# EAGLE design 526_outin_picoRev101 (EAGLE 9.6.0)
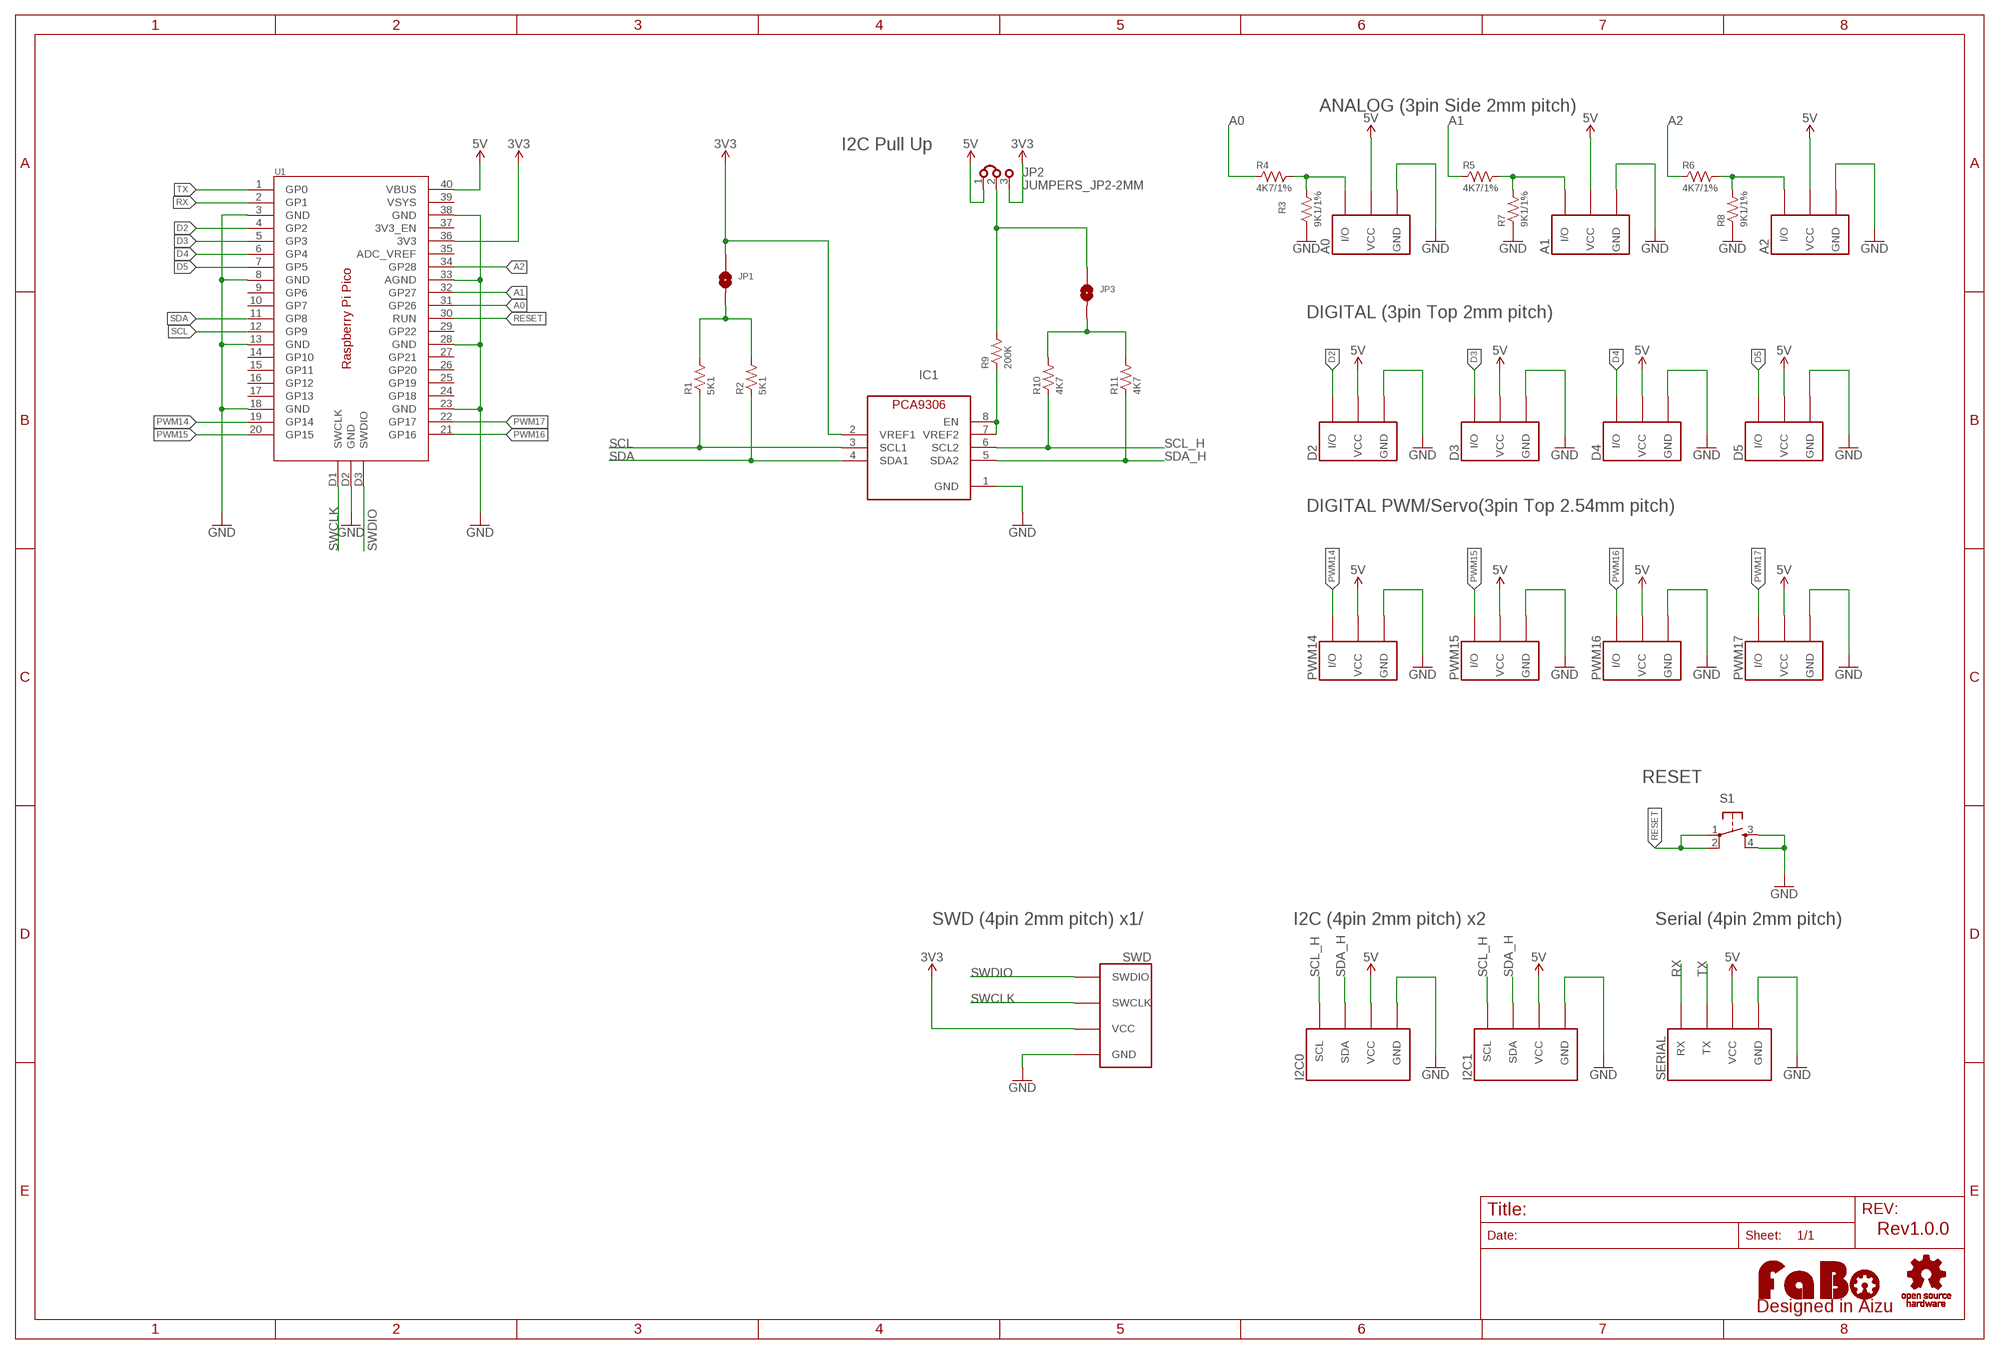
[diagram p0: schematic, sheet 1]

## Parts
A0  FABO_BRICK_3PIN-S03B-PASK-2_LONG  [FABO_BRICK_3PIN_S03B-PASK-2_LONG]
A1  FABO_BRICK_3PIN-S03B-PASK-2_LONG  [FABO_BRICK_3PIN_S03B-PASK-2_LONG]
A2  FABO_BRICK_3PIN-S03B-PASK-2_LONG  [FABO_BRICK_3PIN_S03B-PASK-2_LONG]
D2  FABO_BRICK_3PIN-B03B-PASK-1  [FABO_BRICK_3PIN_B03B-PASK-1]
D3  FABO_BRICK_3PIN-B03B-PASK-1  [FABO_BRICK_3PIN_B03B-PASK-1]
D4  FABO_BRICK_3PIN-B03B-PASK-1  [FABO_BRICK_3PIN_B03B-PASK-1]
D5  FABO_BRICK_3PIN-B03B-PASK-1  [FABO_BRICK_3PIN_B03B-PASK-1]
I2C0  FABO_BRICK_I2C-B04B-PASK-1  [FABO_BRICK_I2C_B04B-PASK-1]
I2C1  FABO_BRICK_I2C-B04B-PASK-1  [FABO_BRICK_I2C_B04B-PASK-1]
IC1  PCA9306_SSOP  [8PIN-SSOP]
JP1  SMD-JUMPER-2_SHORT  [SMD-JUMPER-2-SHORT]
JP2  JUMPERS_JP2-2MM  [JUMPERS_JP2-2MM]
JP3  SMD-JUMPER-2_SHORT  [SMD-JUMPER-2-SHORT]
LOGO1  LOGO_OSHW-M_BOTTOM  [LOGO_OSHW_M_BOTTOM]
LOGO2  LOGO_FABO-M  [LOGO_FABO_M]
PWM14  FABO_BRICK_3PIN-HEADER  [FABO_BRICK_3PIN_HEADER]
PWM15  FABO_BRICK_3PIN-HEADER  [FABO_BRICK_3PIN_HEADER]
PWM16  FABO_BRICK_3PIN-HEADER  [FABO_BRICK_3PIN_HEADER]
PWM17  FABO_BRICK_3PIN-HEADER  [FABO_BRICK_3PIN_HEADER]
R1  5K1  RESISTOR-0603  [0603]
R2  5K1  RESISTOR-0603  [0603]
R3  9K1/1%  RESISTOR-0603  [0603]
R4  4K7/1%  RESISTOR-0603  [0603]
R5  4K7/1%  RESISTOR-0603  [0603]
R6  4K7/1%  RESISTOR-0603  [0603]
R7  9K1/1%  RESISTOR-0603  [0603]
R8  9K1/1%  RESISTOR-0603  [0603]
R9  200K  RESISTOR-0603  [0603]
R10  4K7  RESISTOR-0603  [0603]
R11  4K7  RESISTOR-0603  [0603]
S1  TACT-SWITCH-6MM  [DTS_6_V]
SERIAL  FABO_BRICK_SERIAL-B04B-PASK-1  [FABO_BRICK_SERIAL_B04B-PASK-1]
SWD  FABO-SWD-4PIN  [FABO_BRICK_SWD_B04B-PASK-1_SILK]
U1  RASPBERRY_PI_PICO  [RASPBERRY_PI_PICO_SMD]

## Nets
3V3: IC1.2(VREF1) JP1.1 JP2.3 SWD.VCC U1.36(3V3)
5V: A0.VCC A1.VCC A2.VCC D2.VCC D3.VCC D4.VCC D5.VCC I2C0.VCC I2C1.VCC JP2.1 PWM14.VCC PWM15.VCC PWM16.VCC PWM17.VCC SERIAL.VCC U1.40(VBUS)
A0: R4.1 U1.31(GP26)
A1: R5.1 U1.32(GP27)
A2: R6.1 U1.34(GP28)
D2: D2.I/O U1.4(GP2)
D3: D3.I/O U1.5(GP3)
D4: D4.I/O U1.6(GP4)
D5: D5.I/O U1.7(GP5)
GND: A0.GND A1.GND A2.GND D2.GND D3.GND D4.GND D5.GND I2C0.GND I2C1.GND IC1.1(GND) PWM14.GND PWM15.GND PWM16.GND PWM17.GND R3.1 R7.1 R8.1 S1.3 S1.4 SERIAL.GND SWD.GND U1.3(GND) U1.8(GND) U1.13(GND) U1.18(GND) U1.23(GND) U1.28(GND) U1.33(AGND) U1.38(GND) U1.D2(GND)
N$1: A0.I/O R3.2 R4.2
N$2: A1.I/O R5.2 R7.2
N$3: JP1.2 R1.2 R2.2
N$4: A2.I/O R6.2 R8.2
N$10: JP2.2 JP3.1 R9.2
N$11: JP3.2 R10.2 R11.2
N$12: IC1.7(VREF2) IC1.8(EN) R9.1
PWM14: PWM14.I/O U1.19(GP14)
PWM15: PWM15.I/O U1.20(GP15)
PWM16: PWM16.I/O U1.21(GP16)
PWM17: PWM17.I/O U1.22(GP17)
RESET: S1.1 S1.2 U1.30(RUN)
RX: SERIAL.RX U1.2(GP1)
SCL: IC1.3(SCL1) R1.1 U1.12(GP9)
SCL_H: I2C0.SCL I2C1.SCL IC1.6(SCL2) R10.1
SDA: IC1.4(SDA1) R2.1 U1.11(GP8)
SDA_H: I2C0.SDA I2C1.SDA IC1.5(SDA2) R11.1
SWCLK: SWD.SWCLK U1.D1(SWCLK)
SWDIO: SWD.SWDIO U1.D3(SWDIO)
TX: SERIAL.TX U1.1(GP0)
Unconnected: U1.9(GP6) U1.10(GP7) U1.14(GP10) U1.15(GP11) U1.16(GP12) U1.17(GP13) U1.24(GP18) U1.25(GP19) U1.26(GP20) U1.27(GP21) U1.29(GP22) U1.35(ADC_VREF) U1.37(3V3_EN) U1.39(VSYS)

## Notes on the sheet
- ANALOG (3pin Side 2mm pitch)
- I2C Pull Up
- DIGITAL (3pin Top 2mm pitch)
- DIGITAL PWM/Servo(3pin Top 2.54mm pitch)
- RESET
- SWD (4pin 2mm pitch) x1/ | I2C (4pin 2mm pitch) x2 | Serial (4pin 2mm pitch)
- Rev1.0.0

## Library data of the parts
A0 A1 A2 D2-D5 PWM14-PWM17 = FaBo-Template:FABO_BRICK_3PIN: FaBo Brick 3pin
I2C0 I2C1 = FaBo-Template:FABO_BRICK_I2C: FaBo Brick I2C
IC1 = FaBo-LevelTranslator:PCA9306
JP1 JP3 = FaBo-PIN:SMD-JUMPER-2
JP2 = 52101-101-REV-A_v16:JUMPERS_JP2-: Jumper/Bridge
LOGO1 = FaBo-Logo:LOGO_OSHW
LOGO2 = FaBo-Logo:LOGO_FABO
R1-R11 = FaBo-Resistors:RESISTOR: RESISTOR
S1 = FaBo-Switch:TACT-SWITCH
SERIAL = FaBo-Template:FABO_BRICK_SERIAL: FaBo Brick Serial
SWD = FaBo-Connetor:FABO-SWD-4PIN
U1 = FaBo-Boards:RASPBERRY_PI_PICO

## Board
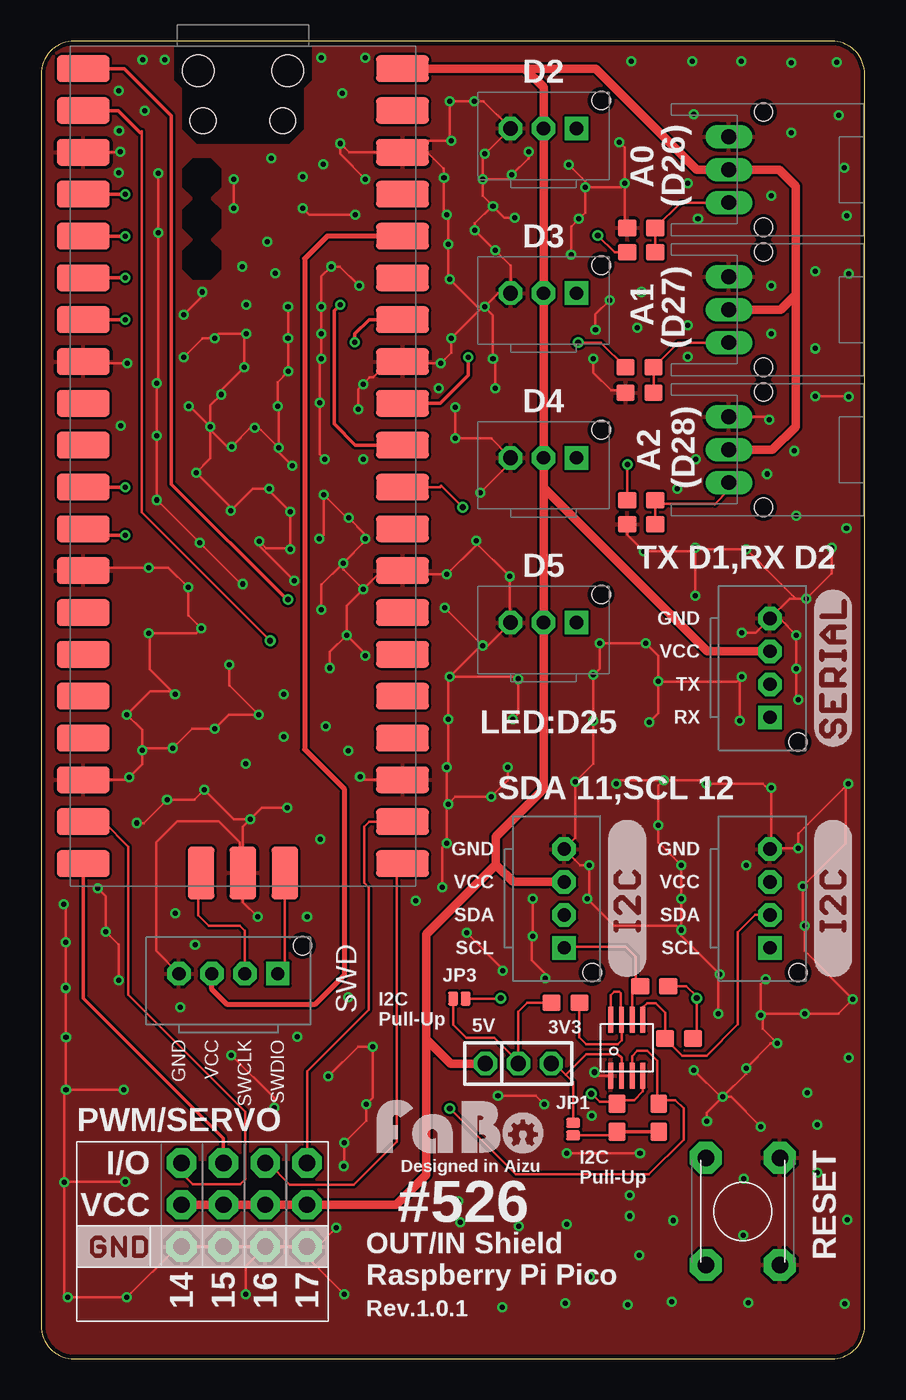
[diagram p1: board, top side]
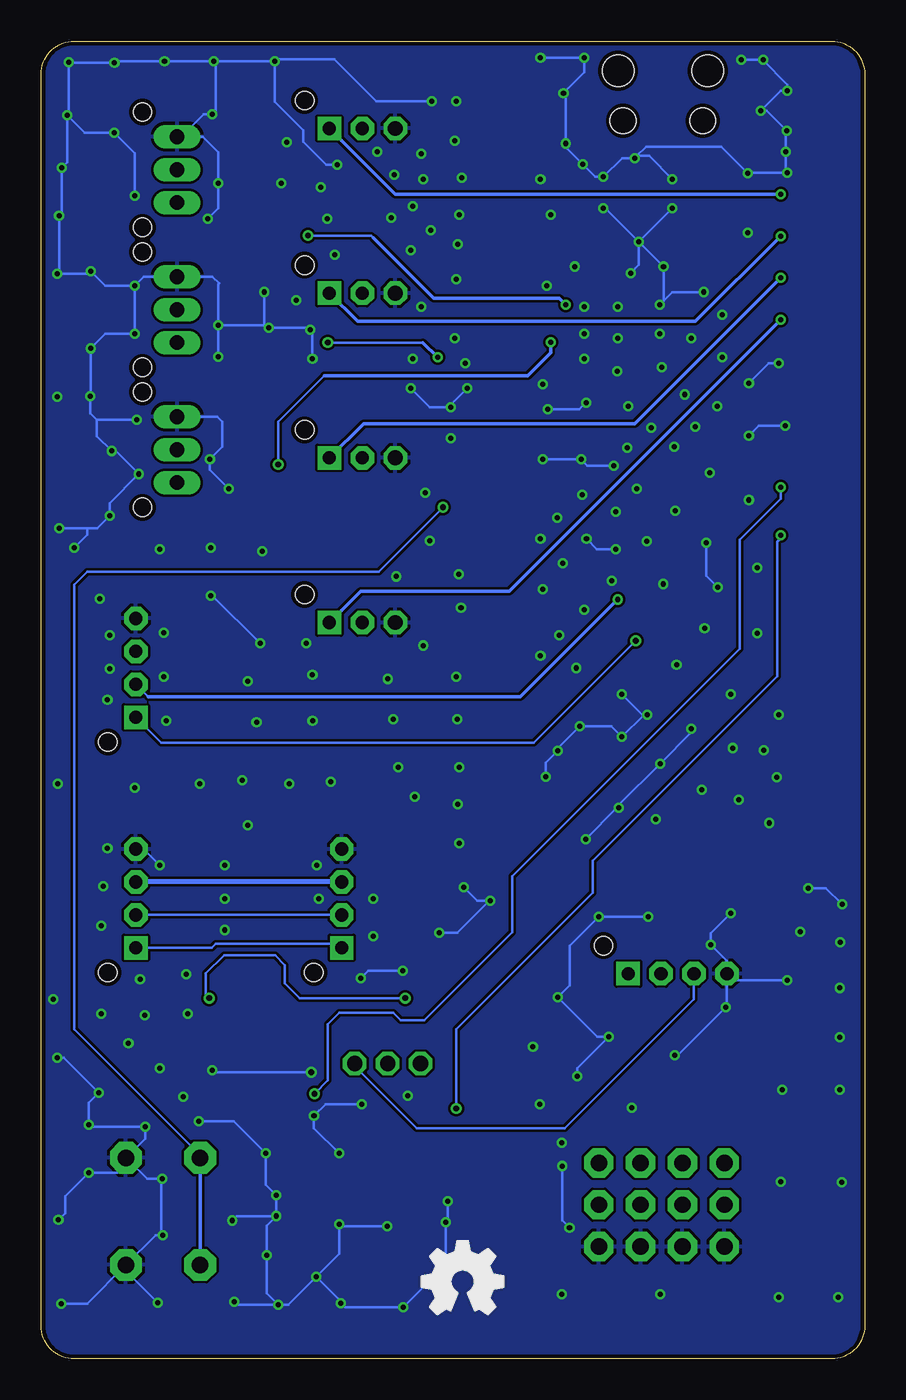
[diagram p2: board, bottom side, seen from below]

Size 50 x 80 mm. Coordinates in mm from the lower left corner, seen from the top.
Outline: 48,80 2,80 arc90 0,78 0,2 arc90 2,0 48,0 arc90 50,2 50,78 arc90 48,80
Copper layers (1*16): Top 0.035mm / dielectric 1.6mm / Bottom 0.035mm
Design rules "PCBway": minimum track width 6mil, minimum drill 12mil, track to track 6mil, track to pad 6mil, pad to pad 6mil, via to via 6mil, smd to smd 6mil, copper to edge 10mil, drill to drill 10mil, minimum pad ring 10mil, minimum via ring 6mil, stop-mask expansion 2mil, vias tented up to drill 100mil, thermal gap 8mil
tRestrict: 2 lines

### Footprints (pad centres in the part's own frame; a part is rotated, then mirrored left to right if it is on the bottom)
FABO_BRICK_3PIN_S03B-PASK-2_LONG = drill 0.9 pad 1.422 long: GND -2,0; I/O 2,0; VCC 0,0 | hole 1.1: 3.5,2.1; -3.5,2.1
FABO_BRICK_3PIN_B03B-PASK-1 = drill 0.9 pad 1.422 octagon: GND -2,0 | drill 0.8 pad 1.422 square: I/O 2,0 | drill 0.8 pad 1.422 octagon: VCC 0,0 | hole 1.1: 3.5,1.7
FABO_BRICK_I2C_B04B-PASK-1 = drill 0.8 pad 1.422 octagon: GND -3,0; SDA 1,0; VCC -1,0 | drill 0.8 pad 1.422 square: SCL 3,0 | hole 1.1: 4.5,1.7
8PIN-SSOP = smd 0.3 x 1.6: 1 -0.975,-1.7; 2 -0.325,-1.7; 3 0.325,-1.7; 4 0.975,-1.7; 5 0.975,1.7; 6 0.325,1.7; 7 -0.325,1.7; 8 -0.975,1.7
SMD-JUMPER-2-SHORT = smd 0.61 x 0.838: 1 -0.381,0; 2 0.381,0
JUMPERS_JP2-2MM = drill 0.914 octagon: 1 -2,0; 2 0,0; 3 2,0
FABO_BRICK_3PIN_HEADER = drill 1 pad 1.778 octagon: GND -2.54,0; I/O 2.54,0; VCC 0,0
0603 = smd 1.1 x 1: 1 -0.85,0; 2 0.85,0
DTS_6_V = drill 1 pad 1.93 octagon: 1 -3.25,2.25; 2 3.25,2.25; 3 -3.25,-2.25; 4 3.25,-2.25
FABO_BRICK_SERIAL_B04B-PASK-1 = drill 0.8 pad 1.422 octagon: GND -3,0; TX 1,0; VCC -1,0 | drill 0.8 pad 1.422 square: RX 3,0 | hole 1.1: 4.5,1.7
FABO_BRICK_SWD_B04B-PASK-1_SILK = drill 0.8 pad 1.422 octagon: GND -3,0; SWCLK 1,0; VCC -1,0 | drill 0.8 pad 1.422 square: SWDIO 3,0 | hole 1.1: 4.5,1.7
RASPBERRY_PI_PICO_SMD = smd 3.2 x 1.6: 1 -9.69,24.13; 2 -9.69,21.59; 3 -9.69,19.05; 4 -9.69,16.51; 5 -9.69,13.97; 6 -9.69,11.43; 7 -9.69,8.89; 8 -9.69,6.35; 9 -9.69,3.81; 10 -9.69,1.27; 11 -9.69,-1.27; 12 -9.69,-3.81; 13 -9.69,-6.35; 14 -9.69,-8.89; 15 -9.69,-11.43; 16 -9.69,-13.97; 17 -9.69,-16.51; 18 -9.69,-19.05; 19 -9.69,-21.59; 20 -9.69,-24.13; 21 9.69,-24.13; 22 9.69,-21.59; 23 9.69,-19.05; 24 9.69,-16.51; 25 9.69,-13.97; 26 9.69,-11.43; 27 9.69,-8.89; 28 9.69,-6.35; 29 9.69,-3.81; 30 9.69,-1.27; 31 9.69,1.27; 32 9.69,3.81; 33 9.69,6.35; 34 9.69,8.89; 35 9.69,11.43; 36 9.69,13.97; 37 9.69,16.51; 38 9.69,19.05; 39 9.69,21.59; 40 9.69,24.13 | smd 1.6 x 3.2: D1 -2.54,-24.7; D2 0,-24.7; D3 2.54,-24.7 | hole 1.9: 2.725,24; -2.725,24 | hole 1.55: 2.425,20.97; -2.425,20.97

### Placement (x,y rotation side)
A0  41.75,72.2 270 top
A1  41.75,63.7 270 top
A2  41.75,55.2 270 top
D2  30.5,74.7 0 top
D3  30.5,64.7 0 top
D4  30.5,54.7 0 top
D5  30.5,44.7 0 top
I2C0  31.75,27.95 270 top
I2C1  44.25,27.95 270 top
IC1  35.56,18.89 0 top
JP1  32.3,13.95 270 top
JP2  28.97,17.93 0 top
JP3  25.39,21.87 0 top
LOGO1  24.4,4.69 0 top
LOGO2  25.43,12.1 0 top
PWM14  8.53,9.36 90 top
PWM15  11.06,9.36 90 top
PWM16  13.61,9.36 90 top
PWM17  16.14,9.36 90 top
R1  37.5,14.64 270 top
R2  34.96,14.64 270 top
R3  36.44,68.66 0 top
R4  36.44,67.19 0 top
R5  36.33,60.2 0 top
R6  36.43,52.12 0 top
R7  36.33,58.65 0 top
R8  36.43,50.67 0 top
R9  31.83,21.61 180 top
R10  37.23,22.62 0 top
R11  38.73,19.45 0 top
S1  42.6,8.95 90 top
SERIAL  44.25,41.95 270 top
SWD  11.37,23.39 0 top
U1  12.25,54.2 0 top
U$2  [LOGO_SILK_SERIAL2]  49.25,41.95 90 top
U$11  [LOGO_SILK_I2C]  49.25,27.95 90 top
U$12  [LOGO_SILK_I2C]  36.75,27.95 90 top
U$19  [LOGO_SILK_GND]  2.81,5.54 0 top

### Tracks (layer width: path | path; a pad name or v marks a point on that pad's centre or on a via)
3V3
  Top 0.152: JP1.1 32.3,16.8 31.85,17.25 | IC1.2 35.23,18.27 35,18.5 33.1,18.5 31.85,17.25 | 31.85,17.25 31.16,17.93 JP2.3
  Top 0.305: U1.36 17.37,68.17 16,66.8 16,37 18.4,34.6 18.4,23.3 16.6,21.5 11.3,21.5 10.37,22.43 SWD.VCC
  Bottom 0.152: SWD.VCC 10.37,21.84 18.2,14 27.2,14 30.97,17.77 JP2.3
5V
  Top 0.305: D2.VCC 30.5,74.4
  Top 0.508: U1.40 29.37,78.33 | 29.37,78.33 30.5,77.2 30.5,74.4 D3.VCC D4.VCC 30.5,52.9 | 29.37,78.33 33.67,78.33 39.8,72.2 A0.VCC 44.8,72.2 45.8,71.2 45.8,64.6 | 30.5,52.9 D5.VCC 30.5,34.6 27.6,31.7 27.6,30 | 27.6,30 28.65,28.95 I2C0.VCC | 27.6,30 23.39,25.79 23.39,19.4 | 23.39,19.4 24.86,17.93 JP2.1 | 23.39,19.4 23.39,11.19 21.55,9.36 PWM17.VCC PWM16.VCC PWM15.VCC PWM14.VCC | A1.VCC 44.9,63.7 45.8,64.6 | A2.VCC 44.4,55.2 45.8,56.6 45.8,64.6 | SERIAL.VCC 40.45,42.95 30.5,52.9
  Bottom 0.305: I2C0.VCC I2C1.VCC
A0  (via drill 0.3, 0.35)
  Top 0.152: R4.1 34.81,67.19 v33.8,68.2
  Top 0.203: U1.31 19.08,55.47 17.78,56.77 17.78,63.63 v18.16,64.01
  Bottom 0.152: v33.8,68.2 29.97,68.2 29.84,68.06
  Bottom 0.203: v18.16,64.01 18.54,64.39 26.16,64.39 29.84,68.06
A1  (via drill 0.3, 0.35)
  Top 0.152: R5.1 33.98,61.7 v32.6,61.7
  Top 0.203: U1.32 24.23,58.01 25.92,59.71 v25.92,60.8
  Bottom 0.152: v32.6,61.7 26.82,61.7
  Bottom 0.203: 26.82,61.7 v25.92,60.8
A2  (via drill 0.3, 0.35)
  Top 0.152: R6.1 35.58,54.3 v35.6,54.3
  Top 0.203: U1.34 19.91,63.09 19.05,62.23 v19.05,61.72
  Bottom 0.152: v35.6,54.3 v35.59,54.31 35.59,56.91 32.81,59.69
  Bottom 0.203: v19.05,61.72 19.05,61.09 20.45,59.69 32.81,59.69
D2  (via drill 0.3)
  Top 0.203: U1.4 v5.11,70.71
  Bottom 0.203: v5.11,70.71 28.51,70.71 D2.I/O
D3  (via drill 0.3)
  Top 0.203: U1.5 v5.11,68.17
  Bottom 0.203: D3.I/O 30.79,62.99 10.29,62.99 v5.11,68.17
D4  (via drill 0.3)
  Top 0.203: U1.6 v5.11,65.63
  Bottom 0.203: D4.I/O 30.43,56.77 13.97,56.77 v5.11,65.63
D5  (via drill 0.3)
  Top 0.203: U1.7 v5.11,63.09
  Bottom 0.203: D5.I/O 30.59,46.61 21.59,46.61 v5.11,63.09
GND  (via drill 0.3, 0.35)
  Top 0.152: SWD.GND 6.99,24.77 6.99,31.37 8.26,32.64 10.79,32.64 12.06,31.37 12.06,28.83 12.25,29.02 U1.D2 | R8.1 35.58,50.02 v36.58,49.02 39.49,49.02 v39.7,49.23 | v7.1,71.98 v7.1,68.38 7.1,59.32 v7.03,59.24 v7.03,56.04 v7.03,52.14 v9.63,49.54 12.13,47.04 v12.23,47.04 | v5.23,60.44 2.67,60.44 U1.8 | U1.13 2.75,48.04 v6.53,48.04 7.73,48.04 v8.93,46.84 8.93,45.14 v9.73,44.34 9.43,44.04 6.6,44.04 | 6.6,44.04 v6.53,44.04 | v8.13,40.34 7.93,40.53 | 7.93,40.53 6.6,41.87 6.6,44.04 | 7.93,40.53 6.62,40.53 v5.21,39.12 6.14,38.18 v6.14,36.95 | v6.14,36.95 6.14,36.11 v5.33,35.31 5.18,35.15 U1.18 | v6.14,36.95 6.28,37.09 v8,37.09 9.16,38.24 v10.53,38.24 11.4,39.12 v13.21,39.12 11.43,40.9 v11.43,42.14 | v17.53,41.94 17.53,42.93 v18.54,43.94 | v18.54,43.94 19.68,42.8 v19.68,42.67 | v18.54,43.94 18.54,45.72 v19.56,46.74 | v17.02,45.47 17.02,46.99 v18.34,48.31 | v19.56,46.74 20.67,47.85 21.9,47.85 | 21.9,47.85 U1.28 | v18.34,48.31 19.68,49.66 v19.68,49.78 19.68,50.04 v18.67,51.05 18.54,51.05 v17.14,52.45 17.14,50.04 v16.89,49.78 | v15.11,49.15 15.11,49.2 | 15.11,49.2 v15.11,51.44 13.84,52.71 v13.84,52.83 12.84,52.83 v11.5,51.5 11.5,51.7 v9.41,53.8 10.28,54.66 10.28,56.4 | v15.37,47.24 13.24,49.37 v13.24,49.63 13.68,49.2 15.11,49.2 | v8.96,57.83 9.03,57.83 v10.28,56.58 | v10.28,56.58 10.28,56.4 | 10.28,56.4 11.31,55.37 v11.56,55.37 12.7,56.52 v12.95,56.52 13.22,56.52 v14.42,55.31 | U1.D2 12.25,32.32 v12.7,32.77 | v12.7,32.77 11.68,32.77 v9.91,34.55 9.31,33.95 v7.64,33.95 6.23,32.53 v5.81,32.53 | v3.43,28.58 3.91,28.1 v3.91,25.93 4.7,25.14 v4.7,22.99 | v1.36,27.59 1.49,27.45 v1.49,25.3 1.49,23.83 1.5,23.82 v1.5,22.52 v1.51,22.51 v1.51,19.53 v1.51,16.33 1.6,16.33
  Top 0.152: 1.6,16.33 v5.01,16.33 | v1.41,10.73 1.41,16.14 1.6,16.33 | v1.41,10.73 1.41,3.93 v1.61,3.73 v5.21,3.73 8.29,6.81 | 8.29,6.81 8.29,6.82 PWM14.GND | v5.1,10.75 1.43,10.75 v1.41,10.73 | v11.54,18.45 14.14,15.85 v14.14,15.24 | v17.44,17.14 19.24,18.95 v20.14,18.95 20.14,15.85 v19.74,15.45 19.74,14.46 v18.4,13.11 18.4,11.73 v18.37,11.71 | v18.41,3.93 16.5,5.84 16.5,6.46 PWM17.GND | v12.41,3.93 12.41,5.62 13.45,6.66 | 13.45,6.66 PWM16.GND PWM17.GND | 13.45,6.66 13.29,6.82 PWM15.GND 8.29,6.81 | PWM17.GND 16.78,6.82 v17.92,7.96 | U1.D2 12.25,27.73 v13.14,26.84 | U1.23 19.55,35.15 v19.36,35.34 | v8.65,63.38 9.78,64.51 v9.78,64.77 | v8.65,60.81 9.82,61.98 v10.54,61.98 10.79,62.23 v12.45,62.23 12.32,62.1 v12.32,60.2 10.92,58.8 v10.92,58.55 10.28,57.91 v10.28,56.58 | v14.42,55.31 14.42,57.76 v14.35,57.83 14.35,59.3 v15.01,59.96 14.99,59.99 v14.99,61.98 v14.99,63.88 | v19.3,65.15 18.14,66.32 v17.62,66.32 17.02,65.72 v17.02,63.88 v17.02,62.23 v17.02,60.71 16.92,60.61 v16.92,58.06 16.92,54.91 v17.22,54.61 | v19.24,57.66 19.24,58.87 v19.56,59.18 19.96,59.58 20.17,59.58 21.14,60.55 U1.33 22.04,60.45 v24.26,60.45 24.89,61.09 v24.89,61.98 26.8,63.88 | v14.42,55.31 14.42,55.05 v15.24,54.23 | v19.68,71.63 18.16,73.15 v18.16,73.79 18.7,73.25 U1.38 22.09,73.4 | v19.07,69.45 16.27,69.45 v15.88,69.85 | R3.1 35.43,68.82 v35.43,71.38 | v35.43,71.38 35.18,71.12 v33.02,71.12 | v33.02,71.12 33.02,69.6 v32.64,69.22 32.17,68.75 v32.17,67.02 | 22.09,73.4 23.3,73.4 24.46,72.24 v24.46,71.7 24.46,69.62 v24.61,69.47 24.71,69.37 v24.71,67.66 24.71,65.65 v24.81,65.55 26.48,63.88 26.8,63.88
  Top 0.152: 22.09,73.4 22.64,73.95 v24.9,73.95 24.8,74.05 v24.8,76.35 v26.3,76.35 26.85,76.35 D2.GND 26.95,73.15 v26.92,73.15 26.8,73.03 v26.8,71.63 | v26.8,71.63 28.32,71.63 v28.57,71.88 29.59,72.9 v29.59,73.28 | v32.02,72.49 33.02,71.49 v33.02,71.12 | v35.1,73.85 35.43,73.52 v35.43,71.38 | v28.75,69.29 28.12,69.29 v27.43,69.98 27.41,70 | 27.41,70 26.8,70.61 v26.8,71.63 | 27.41,70 26.34,68.94 v26.34,68.52 27.55,67.31 v27.56,67.31 28.5,66.37 D3.GND 27.74,64.7 v26.92,63.88 | v26.92,63.88 26.8,63.88 | v26.92,63.88 27.43,63.37 v27.43,60.71 27.56,60.58 v27.56,58.93 | v25.15,57.79 v25.15,55.88 27.32,55.88 28.4,54.8 | 28.4,54.8 D4.GND | v26.67,52.58 28.4,54.31 28.4,54.8 | 21.9,47.85 22.12,47.63 v24.64,47.63 26.42,49.4 v26.42,49.66 26.42,49.53 v28.45,47.5 28.45,44.75 D5.GND 27.11,43.31 v26.8,43.31 | v26.8,43.31 v24.51,45.59 | v24.81,41.42 26.7,43.31 v26.8,43.31 | v24.81,41.42 24.73,41.34 v24.73,38.84 24.73,36.03 v24.62,35.93 24.62,33.77 v24.71,33.68 | v24.81,41.42 28.81,41.42 v28.96,41.28 28.96,39.17 v28.63,38.84 | v24.71,33.68 25.15,34.13 v27.32,34.13 28.32,35.13 v28.32,35.93 | 37.47,41.1 v37.47,41.15 37.47,42.67 v36.7,43.44 v33.91,43.44 33.91,41.91 v33.53,41.53 v33.53,38.74 33.53,36.13 v32.42,35.03 32.42,31.62 I2C0.GND 32.73,29.97 v33.27,29.97 33.27,28.07 v33.15,27.94 34.79,26.3 38.56,26.3 38.86,26 | 37.47,41.1 37.47,39.18 v36.93,38.64 | v39.7,46.34 v39.7,49.23 | v39.7,49.23 39.79,49.15 v42.8,49.15 45.8,46.15 v46.45,46.15 | v46.45,46.15 45.45,46.15 SERIAL.GND | SERIAL.GND 43.37,44.07 v42.55,44.07 | SERIAL.GND 44.84,44.95 v45.85,43.94 v45.85,41.91 45.85,40.13 v45.97,40.01
  Top 0.152: v42.42,38.74 42.42,41.28 v42.55,41.4 42.24,41.1 37.47,41.1 | v46.45,46.15 48,47.7 v48,49.23 | v44.32,34.67 44.32,34.4 | 44.32,34.4 44.32,31.02 I2C1.GND 44.29,30.99 v45.97,30.99 45.97,31.89 48.84,34.76 | v49,34.92 48.84,34.76 | 48.84,34.76 48.84,31.32 v46.23,28.7 46.23,26.42 v46.35,26.29 46.35,24.77 v49.28,21.84 48.39,20.96 v46.35,20.96 43.8,20.96 | 43.8,20.96 v43.7,20.85 43.7,22.75 v44,23.05 | 38.86,26 38.86,25.69 v41.2,23.35 41.1,23.25 v41.1,20.95 | 38.86,26 v38.86,26.04 v38.86,27.94 v38.86,29.97 37.47,31.37 v37.47,32.39 37.47,34.8 v37.8,35.13 | v37.8,35.13 40.18,35.13 v40.39,34.93 43.8,34.93 44.32,34.4 | v37.8,35.13 35.13,35.13 v34.92,34.93 | v33.66,62.48 33.66,63.41 v34.52,64.28 | v30.61,23.11 30.61,23.39 29.8,24.2 29.8,25.61 v29.84,25.66 v29.84,27.94 | v39.62,17.53 41.25,15.9 v41.39,15.9 | v40.42,14.43 40.42,14.93 v41.39,15.9 | v41.39,15.9 42.8,17.31 v42.8,17.65 44.3,19.15 v44.7,19.15 43.8,20.05 43.8,20.96 | v41.39,15.9 41.89,15.9 v43.69,14.1 | v36.36,12.48 v31.91,12.48 | IC1.1 33.81,17.19 v33.6,17.4 | v27.74,15.97 30.04,15.97 v30.54,15.47 | v12.7,32.77 13.38,33.45 v14.94,33.45 | v47.01,58.45 48.99,58.45 v49.02,58.42 | U1.3 4.77,73.25 v4.8,73.28 | v11.68,71.63 v11.68,69.85 | v18.34,48.31 18.34,47.95 v19.56,46.74 | R7.1 35.33,58.8 34.6,58.8 33.53,59.87 v33.53,60.71 | A2.GND 44.02,57.2 v44.2,57.02 | v24.71,33.68 24.63,33.6 v24.63,31.3 24.35,31.02 v24.35,28.63 | v25.84,25.87 28.04,23.67 v28.04,23.57
  Bottom 0.152: v7.49,78.87 6.2,78.87 | 6.2,78.87 v6.15,78.87 | 6.2,78.87 4.7,77.37 v4.7,76.98 5.1,76.98 v6.3,75.78 5.95,75.78 v4.73,74.56 4.8,74.48 v4.8,73.28 4.8,72.11 v4.7,72.01 7.07,72.01 v7.1,71.98 8.72,73.6 13.27,73.6 13.84,73.03 | 13.84,73.03 v13.97,72.9 14.73,72.9 v15.88,71.76 16.35,71.76 v17.12,72.52 18.16,73.56 v18.16,73.79 18.16,76.71 v18.29,76.84 17.02,78.11 v17.02,79 v19.68,79 | v11.68,71.63 13.09,73.03 13.84,73.03 | v9.78,64.77 11.68,64.77 v12.45,64.01 12.22,64.24 v12.22,66.32 v13.72,67.82 | v13.72,67.82 13.72,66.42 v14.22,65.92 | v13.72,67.82 v11.68,69.85 | v15.88,69.85 15.75,69.85 v13.72,67.82 | v5.23,60.44 5.83,60.44 v7.03,59.24 | v9.63,49.54 9.63,47.54 v8.93,46.84 | v10.53,38.24 10.53,38.04 v12.43,36.14 14.94,33.63 v14.94,33.45 15.04,33.45 v16.94,31.55 | v17.92,7.96 18.37,8.4 v18.37,11.71 | v17.44,17.14 17.44,17.64 v15.54,19.55 16.24,19.55 v18.64,21.95 17.9,22.68 17.9,25.09 v16.14,26.84 v13.14,26.84 | v11.54,18.45 11.34,18.45 v8.44,21.34 8.37,21.42 SWD.GND | SWD.GND 7.97,22.99 v4.7,22.99 | SWD.GND 8.37,24.17 v9.34,25.14 9.34,25.84 v8.14,27.05 | v1.36,27.59 2.35,28.58 v3.43,28.58 | v22.73,27.81 22.8,27.81 | 22.8,27.81 23.53,27.81 v24.35,28.63 | v14.74,40.36 13.49,39.12 v13.21,39.12 13.39,39.12 v14.74,37.76 15.39,38.41 v17.29,38.41 18.64,37.06 v18.64,36.91 19.36,36.2 v19.36,35.34 | v4.83,56.64 6.43,56.64 v7.03,56.04 | v15.24,54.23 16.84,54.23 v17.22,54.61 v19.55,54.61 v19.56,54.61 | v19.24,57.66 17.32,57.66 v16.92,58.06 | v24.13,58.93 25.15,57.91 v25.15,57.79 26.42,57.79 v27.56,58.93 | v33.53,60.71 33.53,62.36 v33.66,62.48 33.78,62.61 v36.2,62.61 | v36.2,62.61 36.45,62.87 v36.45,64.77
  Bottom 0.152: v36.2,62.61 36.32,62.74 v39.24,62.74 | v39.24,62.74 39.24,65.26 39.2,65.3 39.6,65.7 A1.GND 43.77,65.7 v44.32,65.15 | v44.32,65.15 46.1,65.15 46.92,65.97 | 46.92,65.97 v46.99,66.04 | v44.32,65.15 v44.32,62.23 46.1,62.23 v46.99,61.34 46.99,58.47 v47.01,58.45 47.01,57.41 46.62,57.02 | v44.32,70.61 44.32,73.21 v45.55,74.43 47.35,74.43 v48.43,75.51 | 41.5,74.2 40.2,74.2 39.24,73.24 v39.24,71.38 39.24,69.85 v39.88,69.22 | 41.5,74.2 A0.GND | 41.5,74.2 40.13,75.57 v39.62,75.57 39.4,75.79 39.4,78.8 | v36.7,43.44 39.6,46.34 v39.7,46.34 | 39.4,78.8 v35.82,78.8 35.82,78.7 | 39.4,78.8 v39.52,78.8 42.48,78.8 v42.51,78.77 45.47,78.77 v45.55,78.69 48.27,78.69 v48.31,78.73 48.31,75.63 v48.43,75.51 | v48.43,75.51 48.43,72.65 v48.76,72.32 48.76,69.55 v48.92,69.4 48.92,65.99 v49.02,65.88 47.02,65.88 46.92,65.97 | v44.2,57.02 46.62,57.02 | 46.62,57.02 46.62,56.02 v45.72,55.12 45.47,55.12 v44.07,53.72 45.85,51.94 v45.85,51.18 46.61,50.42 47.2,50.42 | 47.2,50.42 v48.9,50.42 | v48,49.23 47.2,50.04 47.2,50.42 | v40.42,14.43 38.31,14.43 v36.36,12.48 36.36,10.58 v35.72,9.94 v35.72,8.67 | v35.72,8.67 38.12,8.67 v38.39,8.4 | v35.72,8.67 36.31,8.08 v36.31,6.29 36.31,3.99 v35.61,3.29 | v38.28,3.46 38.11,3.29 v35.61,3.29 | v35.61,3.29 35.01,3.29 v33.31,4.99 | v33.31,4.99 31.81,3.49 v31.81,3.39 31.55,3.13 v28.01,3.13 25.43,5.7 v25.43,8.29 25.31,8.42 v25.31,9.56 | v33.31,4.99 31.91,6.38 v31.91,8.16 31.81,8.06 v28.99,8.06 | S1.3 44.85,5.34 v42.93,3.42 | v42.63,7.49 42.7,7.49 | 42.7,7.49 43.06,7.49 S1.3 | 42.7,7.49 42.7,10.88 v42.66,10.92 43.57,10.92 44.67,12.03 | 44.67,12.03 S1.4 43.69,13.36 v43.69,14.1 46.91,14.1 47.12,14.3
  Bottom 0.152: 47.12,14.3 47.12,15.54 v46.5,16.15 48.63,18.29 v49.02,18.29 | 47.12,14.3 v47.12,14.22 | 44.67,12.03 45.4,11.3 v47.12,11.3 48.55,9.87 48.55,8.84 v48.95,8.44 | S1.3 47.2,3.35 v48.79,3.35 | v33.6,17.4 39.5,17.4 v39.62,17.53 | v31.91,12.48 33.44,14.01 v33.44,14.77 32.74,15.47 v30.54,15.47 | v28.04,23.57 30.16,23.57 v30.61,23.11 | v15.11,49.15 16.26,49.15 v16.89,49.78 | v32.02,72.49 32.69,72.49 34.1,73.9 34.1,74.6 35.82,76.32 35.82,78.7 | v26.3,76.35 29.65,76.35 32.2,78.9 35.62,78.9 35.82,78.7 | v38.61,52.83 39.75,53.98 v39.75,54.61 39,55.36 39,56.9 39.3,57.2 A2.GND | v39.24,62.74 v39.24,60.83 | v42.8,29.97 43.78,30.95 I2C1.GND | v25.84,25.87 24.75,25.87 22.8,27.81
  pour Top (isolate 0.152, rank 3): -2,-3.9 -2,80.72 51.8,80.72 51.8,-3.9
  pour Bottom (isolate 0.152, rank 3): -1.7,-5.4 -1.7,81.98 52.2,81.98 52.2,-5.4
N$1
  Top 0.152: R4.2 R3.2 38.83,70.2 A0.I/O
N$2
  Top 0.152: R7.2 R5.2 38.69,61.7 A1.I/O
N$3
  Top 0.152: R2.2 34.74,13.57 JP1.2
  Top 0.203: R2.2 R1.2
N$4
  Top 0.152: R6.2 37.7,52.12 37.5,51.92 | 37.5,51.92 40.88,51.92 40.9,51.9 41.75,52.75 A2.I/O | R8.2 37.28,51.7 37.5,51.92
N$10
  Top 0.152: R9.2 29.51,21.61 28.97,21.07 JP2.2 28.97,18.03 27.5,19.5 25.8,19.5 25.01,20.29 JP3.1
N$11  (via drill 0.35)
  Top 0.152: R10.2 39.18,22.62 39.8,22 v39.8,21.9 39.8,19.66 R11.2 | JP3.2 27.87,21.87 v27.9,21.9
  Bottom 0.152: v27.9,21.9 34.3,21.9 35.2,22.8 35.2,23.9 35.8,24.5 38.9,24.5 40,23.4 40,22.1 v39.8,21.9
N$12
  Top 0.152: IC1.7 35.23,20.5 | 35.23,20.5 35.23,19.34 35,19.1 33.1,19.1 32.68,19.52 R9.1 | IC1.8 34.59,22.09 34.8,22.3 35.1,22.3 35.2,22.2 35.2,20.54 35.23,20.5
PWM14
  Top 0.152: PWM14.I/O 8.53,11.28 9.2,10.6 12.1,10.6 12.4,10.9 12.4,15 5.3,22.1 5.3,31.1 3.79,32.61 U1.19
PWM15
  Top 0.203: U1.20 2.56,21.9 11.06,13.39 PWM15.I/O
PWM16
  Top 0.152: PWM16.I/O 13.78,11.89 15.1,10.58 18.98,10.58 21.59,13.19 21.59,29.71
  Top 0.203: 21.59,29.71 U1.21
PWM17
  Top 0.152: 22.5,32.61 19.91,32.61 19.6,32.3 19.6,28.9 19.9,28.6 19.9,21.2 16.14,17.45 PWM17.I/O
  Top 0.203: U1.22 22.5,32.61
RESET  (via drill 0.35)
  Top 0.152: U1.30 24.23,52.93 24.3,53 v25.6,51.7
  Bottom 0.152: v25.6,51.7 29.5,47.8 47.2,47.8 48,47 48,20 40.35,12.35 S1.2
  Bottom 0.203: S1.2 S1.1
RX  (via drill 0.35)
  Top 0.152: 6.01,74.45 6.1,74.54 6.1,51.4 v13.9,43.6
  Top 0.203: U1.2 4.67,75.79 6.01,74.45
  Bottom 0.152: v13.9,43.6 20.1,37.4 42.7,37.4 SERIAL.RX
SCL  (via drill 0.3, 0.35)
  Top 0.152: R1.1 37.4,15.59 37.4,15.7 | IC1.3 35.88,18.39 36.2,18.7 36.8,18.7 37.4,18.1 37.4,15.7 | v24.8,15.2 28.8,11.2 36.9,11.2 39,13.3 39,15.2 38.5,15.7 37.4,15.7
  Top 0.203: U1.12 2.96,49.99 v5.11,49.99
  Bottom 0.152: v5.11,49.99 5.11,49.79 5.3,49.6 5.3,41.44 16.5,30.24 16.5,28.3 24.8,20 v24.8,15.2
SCL_H
  Top 0.152: I2C0.SCL 31.82,25.02 35.48,25.02 36.1,24.4 36.1,22.9 R10.1 35.88,22.12 IC1.6
  Bottom 0.152: I2C1.SCL 39.65,24.95 39.4,25.2 32,25.2 I2C0.SCL
SDA  (via drill 0.3, 0.35)
  Top 0.152: IC1.4 36.53,16.23 36,15.7 35.17,15.7 R2.1 34.85,15.6 33.9,15.6 v33.4,16.1
  Top 0.203: U1.11 v5.11,52.93
  Bottom 0.152: v5.11,52.93 5.11,52.23 7.6,49.74 7.6,43.1 21.4,29.3 21.4,25.9 26.75,20.55 28.16,20.55 28.61,21 31.9,21 32.6,20.3 32.6,16.9 v33.4,16.1
SDA_H
  Top 0.152: IC1.5 36.53,21.34 36.8,21.6 37.3,21.6 37.88,21.02 R11.1 38.92,18.4 40.4,18.4 42.3,20.3 42.3,25.9 43.35,26.95 I2C1.SDA
  Bottom 0.152: I2C0.SDA I2C1.SDA
SWCLK
  Top 0.152: SWD.SWCLK 12.37,25.99 12.06,26.29 10.16,26.29 9.53,26.93 9.53,29.32 U1.D1
SWDIO
  Top 0.152: U1.D3 14.79,23.81 SWD.SWDIO
TX  (via drill 0.3)
  Top 0.203: U1.1 5.04,78.33 7.89,75.48 7.89,53.11 14.9,46.1 v14.99,46.1
  Bottom 0.152: 43.49,40.19 SERIAL.TX
  Bottom 0.203: v14.99,46.1 20.9,40.19 43.49,40.19

### Text on the board
tPlace: (D26) | (D27) | (D28) | TX D1,RX D2 | GND | VCC | TX | RX | LED:D25 | SDA 11,SCL 12 | GND | GND | VCC | VCC | SDA | SDA | SCL | SCL | I2C / Pull-Up | 5V | 3V3 | PWM/SERVO | I2C / Pull-Up | I/O | Designed in Aizu | VCC | RESET | #526 | 14 | 15 | 16 | 17 | OUT/IN Shield / Raspberry Pi Pico | Rev.1.0.1
Document: Raspberry Pi Pico Rev.1.0.1